# EAGLE schematic Arduino_fuer_LEDs_DCC_1.8.2 (EAGLE 9.6.2)

## Sheet 1 of 2
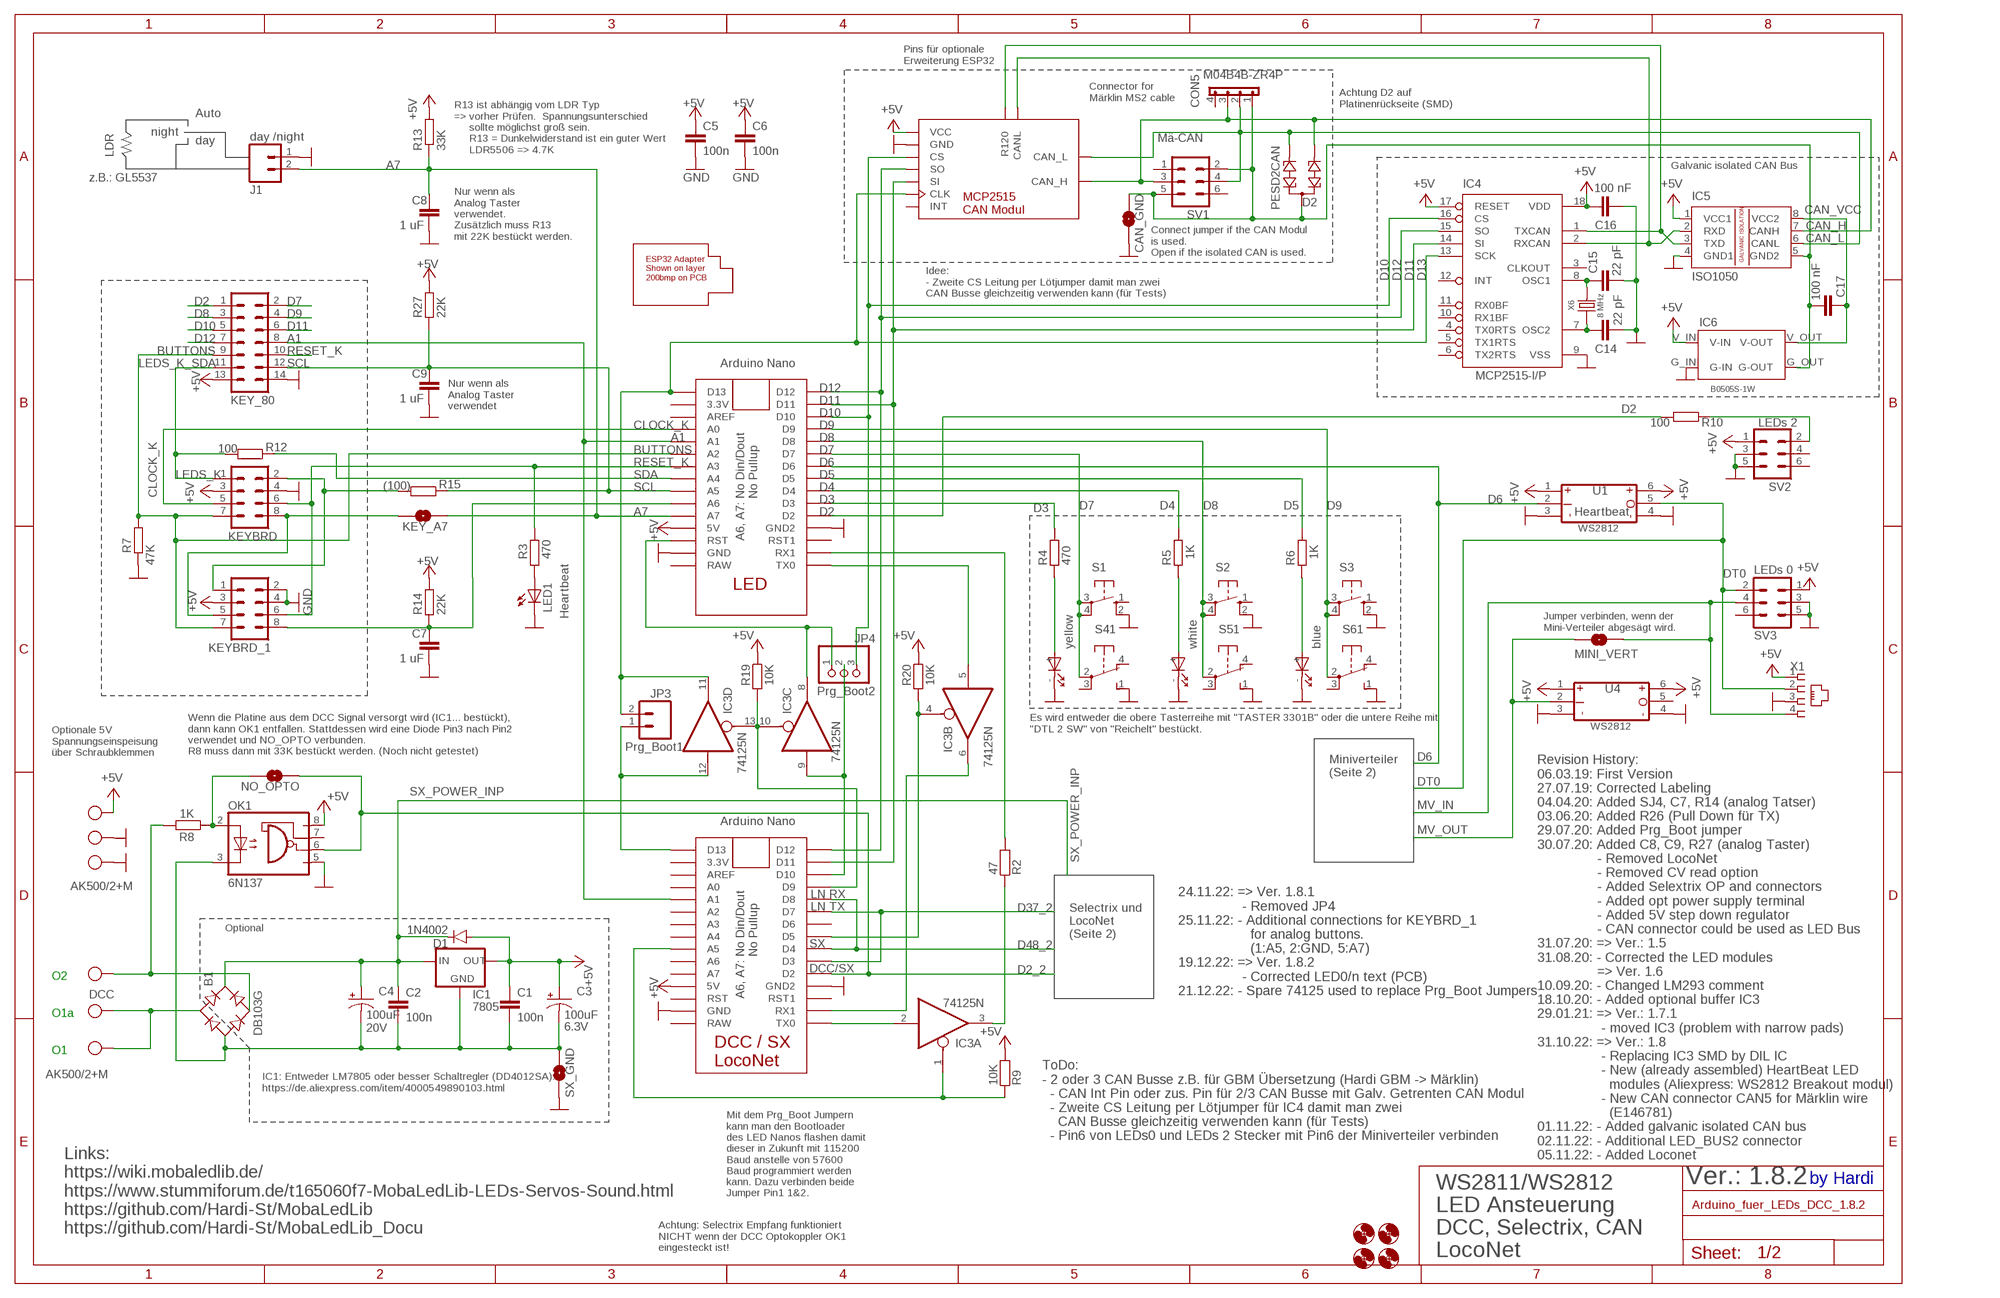
[diagram p0: schematic, sheet 1]

### Parts
B1  DB103G  DBDB10G  [DB]
C1  100n  C-EU025-025X050  [C025-025X050]
C2  100n  C-EU025-025X050  [C025-025X050]
C3  100uF  SPARKFUN-CAPACITORS_100UF-25V-20%(PTH)  [SPARKFUN-CAPACITORS_CPOL-RADIAL-100UF-25V]
C4  100uF  SPARKFUN-CAPACITORS_100UF-25V-20%(PTH)  [SPARKFUN-CAPACITORS_CPOL-RADIAL-100UF-25V]
C5  100n  C-EU025-025X050  [C025-025X050]
C6  100n  C-EU025-025X050  [C025-025X050]
C7  1 uF  C-EU025-025X050  [C025-025X050]
C8  1 uF  C-EU025-025X050  [C025-025X050]
C9  1 uF  C-EU025-025X050  [C025-025X050]
C14  22 pF  C2.5/2  [C2.5-2]
C15  22 pF  C2.5/2  [C2.5-2]
C16  100 nF  C2.5/2  [C2.5-2]
C17  100 nF  C2.5/2  [C2.5-2]
CAN2  MCP2515_CAN_MODUL  [MCP2515_CAN_MODUL]
CAN_GND  SOLDERJUMPERNO  [SJ_2S-NO]
CON5  M04B4B-ZR4P  [B4B-ZR4P]
D1  1N4002  1N4004  [DO41-10]
D2  PESD2CAN  PESD1CAN  [SOT23]
H1  MOUNT-HOLE3.0  [3,0]
H2  MOUNT-HOLE3.0  [3,0]
H3  MOUNT-HOLE3.0  [3,0]
H4  MOUNT-HOLE3.0  [3,0]
IC1  7805  78XXS  [78XXS]
IC3  74125N  [DIL14]
IC4  MCP2515-I/P  [DIL18]
IC5  ISO1050  [DIL08]
IC6  B0505S-1W  DCDC  [DCDC-TEA_NME]
J1  day /night  M02PTH  [1X02]
JP3  Prg_Boot1  M02PTH  [1X02]
JP4  Prg_Boot2  PINHD-1X3CB  [1X03-CLEANBIG]
KEY_80  ML14  [ML14]
KEY_A7  SOLDERJUMPERNO  [SJ_2S-NO]
KEYBRD  CON-HARTING-ML_ML08  [CON-HARTING-ML_ML08]
KEYBRD_1  CON-HARTING-ML_ML08  [CON-HARTING-ML_ML08]
LED1  Heartbeat  LED3MM  [LED3MM]
MINI_VERT  SOLDERJUMPERNO  [SJ_2S-NO]
NO_OPTO  SOLDERJUMPERNO  [SJ_2S-NO]
OK1  6N137  [DIL08]
R2  47  R-EU_0204/7  [0204/7]
R3  470  R0204/7  [0204/7]
R4  470  R0204/7  [0204/7]
R5  1K  R0204/7  [0204/7]
R6  1K  R0204/7  [0204/7]
R7  47K  R0204/7  [0204/7]
R8  1K  R0204/7  [0204/7]
R9  10K  R-EU_0204/7  [0204/7]
R10  100  R0204/7  [0204/7]
R12  100  R0204/7  [0204/7]
R13  33K  R0204/7  [0204/7]
R14  22K  R0204/7  [0204/7]
R15  (100)  R0204/7  [0204/7]
R19  10K  R-EU_0207/2V  [0207/2V]
R20  10K  R-EU_0207/2V  [0207/2V]
R27  22K  R0204/7  [0204/7]
S1  10-XX  [B3F-10XX]
S2  10-XX  [B3F-10XX]
S3  10-XX  [B3F-10XX]
S4  yellow  SRKL  [SRKL]
S5  white  SRKL  [SRKL]
S6  blue  SRKL  [SRKL]
SV1  Mä-CAN  ML6  [ML6]
SV2  LEDs 2  ML6  [ML6]
SV3  LEDs 0  ML6  [ML6]
SX_GND  SOLDERJUMPERNO  [SJ_2S-NO]
U1  WS2812_BREAKOUT  [WS2812__BREAKOUT]
U2  LED NANO  NANO  [NANO]
U3  DCC NANO  NANO  [NANO]
U4  WS2812_BREAKOUT  [WS2812__BREAKOUT]
U$1  ESP_ADAPTER  [ESP_ADAPTER]
X1  RJ10  [RJ10]
X2  AK500/2+M  [AK500/2+M]
X4  AK500/2+M  [AK500/2+M]
X6  8 MHz  CRYSTAL-HC49U-V  [HC49U-V]

### Nets
+5V: C1.1 C3.1(+) C5.1 C6.1 C16.1 CAN2.1(VCC) D1.A IC1.OUT IC4.17(RESET) IC4.18(VDD) IC5.1(VCC1) IC6.V_IN(V-IN) KEY_80.13 KEYBRD.3 KEYBRD_1.3 OK1.8(VCC) R9.2 R13.2 R14.2 R19.1 R20.1 R27.2 SV2.1 SV3.1 U1.1(VDD1) U1.6(VDD) U2.5V U3.5V U4.1(VDD1) U4.6(VDD) X1.1 X4.2 ; also sheet 2
A1: KEY_80.8 U2.A1 U3.A1
A7: C8.1 J1.2 KEY_A7.1 R13.1 U2.A7
BUTTONS: KEY_80.9 KEYBRD.7 KEYBRD_1.7 R7.2 U2.A2
CAN_H: CAN2.9(CAN_H) CON5.3 D2.1 IC5.7(CANH) SV1.3
CAN_L: CAN2.8(CAN_L) CON5.2 D2.2 IC5.6(CANL) SV1.4
CAN_VCC: C17.1 IC5.8(VCC2) IC6.V_OUT(V-OUT)
CLOCK_K: KEYBRD.5 U2.A0
D2: KEY_80.1 R10.2 U2.D2
D2_2: NO_OPTO.1 OK1.6(VO) U3.D2 ; also sheet 2
D3: R4.2 U2.D3
D4: R5.2 U2.D4
D5: R6.2 U2.D5
D6: U1.2(DIN) U2.D6
D7: KEY_80.2 S1.3(P) S1.4(P1) S4.2(1:P) U2.D7
D8: KEY_80.3 S2.3(P) S2.4(P1) S5.2(1:P) U2.D8
D9: KEY_80.4 S3.3(P) S3.4(P1) S6.2(1:P) U2.D9
D10: CAN2.3(CS) IC4.16(CS) JP4.3 KEY_80.5 U2.D10
D11: CAN2.5(SI) IC4.14(SI) KEY_80.6 U2.D11 U3.D11
D12: CAN2.4(SO) IC4.15(SO) KEY_80.7 U2.D12 U3.D12
D13: CAN2.6(CLK) IC3.11(D:O) IC4.13(SCK) JP3.2 U2.D13
D37_2: U3.D3 U3.D7 ; also sheet 2
D48_2: U3.D4 U3.D8 ; also sheet 2
DCC/SX_GND: B1.- C1.2 C2.2 C3.2(-) C4.2(-) IC1.GND OK1.3(C) SX_GND.1
DT0: SV3.2 U1.5(DO) X1.2
GND: C5.2 C6.2 C7.2 C8.2 C9.2 C14.2 C15.2 C16.2 CAN2.2(GND) CAN_GND.2 IC4.9(VSS) IC5.4(GND1) IC6.G_IN(G-IN) J1.1 KEY_80.14 KEYBRD.4 KEYBRD_1.2 KEYBRD_1.4 LED1.K(C) OK1.5(GND) R7.1 S1.2(S1) S2.2(S1) S3.2(S1) S4.1(1:S) S4.-(D1:C) S5.1(1:S) S5.-(D1:C) S6.1(1:S) S6.-(D1:C) SV2.3 SV2.5 SV3.3 SV3.5 SX_GND.2 U1.3(GND1) U1.4(GND) U2.GND U2.GND1(GND2) U3.GND U3.GND1(GND2) U4.3(GND1) U4.4(GND) X1.3 X4.1 X4.M ; also sheet 2
GND2: C17.2 CAN_GND.1 CON5.1 D2.3 IC5.5(GND2) IC6.G_OUT(G-OUT) SV1.2 SV1.5
LEDS_K_SDA: KEY_80.11 KEYBRD.1 R12.2
MV_IN: MINI_VERT.2 SV3.4 X1.4 ; also sheet 2
MV_OUT: MINI_VERT.1 U4.2(DIN) ; also sheet 2
N$1: IC3.5(B:I) U2.TX0
N$3: IC3.1(A:OE) R9.1 U3.A5
N$4: R4.1 S4.+(D1:A)
N$5: R10.1 SV2.2
N$6: R5.1 S5.+(D1:A)
N$7: R6.1 S6.+(D1:A)
N$8: B1.AC1 X2.1 X2.M
N$11: IC3.10(C:OE) IC3.13(D:OE) R19.2 U3.D9
N$12: B1.AC2 R8.2 X2.2
N$15: IC3.8(C:O) JP4.1 U2.RST
N$16: IC3.4(B:OE) R20.2 U3.D5
N$18: IC3.6(B:O) U3.RX1
N$19: LED1.A R3.1
N$20: IC3.12(D:I) JP3.1 U3.D13
N$21: NO_OPTO.2 OK1.2(A) R8.1
N$24: KEYBRD.2 KEYBRD_1.1 R15.2
N$25: KEY_A7.2 KEYBRD.8 KEYBRD_1.5
N$27: C7.1 KEYBRD_1.8 R14.1 U2.A6
N$28: IC3.9(C:I) JP4.2 U3.D10
N$31: IC3.2(A:I) U3.TX0
N$33: IC3.3(A:O) R2.1
N$34: R2.2 U2.RX1
OSC1: C15.1 IC4.8(OSC1) X6.2
OSC2: C14.1 IC4.7(OSC2) X6.1
RESET_K: KEY_80.10 KEYBRD.6 KEYBRD_1.6 R3.2 U2.A3
RXCAN: CAN2.11(CANL) IC4.2(RXCAN) IC5.2(RXD)
SCL: C9.1 KEY_80.12 R15.1 R27.1 U2.A5
SDA: R12.1 U2.A4
SX_POWER_INP: B1.+ C2.1 C4.1(+) D1.C IC1.IN ; also sheet 2
TXCAN: CAN2.10(R120) IC4.1(TXCAN) IC5.3(TXD)
Unconnected: CAN2.7(INT) CON5.4 IC4.3(CLKOUT) IC4.4(TX0RTS) IC4.5(TX1RTS) IC4.6(TX2RTS) IC4.10(RX1BF) IC4.11(RX0BF) IC4.12(INT) OK1.7(VE) S1.1(S) S2.1(S) S3.1(S) S4.3(1:P) S4.4(1:O) S5.3(1:P) S5.4(1:O) S6.3(1:P) S6.4(1:O) SV1.1 SV1.6 SV2.4 SV2.6 SV3.6 U2.3.3V U2.AREF U2.RAW U2.RST1 U3.3.3V U3.A0 U3.A2 U3.A3 U3.A4 U3.A6 U3.A7 U3.AREF U3.D6 U3.RAW U3.RST U3.RST1 U4.5(DO)

### Notes on the sheet
- Pins für optionale
  Erweiterung ESP32
- R13 ist abhängig vom LDR Typ
  => vorher Prüfen.  Spannungsunterschied
       sollte möglichst groß sein.
       R13 = Dunkelwiderstand ist ein guter Wert
       LDR5506 => 4.7K
- Connector for
  Märklin MS2 cable
- Achtung D2 auf 
  Platinenrückseite (SMD)
- Auto
- night
- day
- LDR
- Galvanic isolated CAN Bus
- z.B.: GL5537
- Nur wenn als
  Analog Taster
  verwendet.
  Zusätzlich muss R13 
  mit 22K bestückt werden.
- Connect jumper if the CAN Modul
  is used.
  Open if the isolated CAN is used.
- Idee:
  - Zweite CS Leitung per Lötjumper damit man zwei 
  CAN Busse gleichzeitig verwenden kann (für Tests)
- Nur wenn als
  Analog Taster
  verwendet
- LEDS_K
- Heartbeat
- A6, A7: No Din/Dout 
              No Pullup
- LED
- Jumper verbinden, wenn der
  Mini-Verteiler abgesägt wird.
- Wenn die Platine aus dem DCC Signal versorgt wird (IC1... bestückt), 
  dann kann OK1 entfallen. Stattdessen wird eine Diode Pin3 nach Pin2
  verwendet und NO_OPTO verbunden.
  R8 muss dann mit 33K bestückt werden. (Noch nicht getestet)
- Es wird entweder die obere Tasterreihe mit "TASTER 3301B" oder die untere Reihe mit 
  "DTL 2 SW" von "Reichelt" bestückt.
- Optionale 5V
  Spannungseinspeisung
  über Schraubklemmen
- Miniverteiler
  (Seite 2)
- 24.11.22: => Ver. 1.8.1
                  - Removed JP4
  25.11.22: - Additional connections for KEYBRD_1
                    for analog buttons.
                    (1:A5, 2:GND, 5:A7) 
  19.12.22: => Ver. 1.8.2
                  - Corrected LED0/n text (PCB)
  21.12.22: - Spare 74125 used to replace Prg_Boot Jumpers
- LN RX
- Selectrix und
  LocoNet
  (Seite 2)
- LN TX
- Optional
- SX
- DCC/SX
- O2
- DCC
- A6, A7: No Din/Dout 
              No Pullup
- O1a
- DCC / SX
  LocoNet
- O1
- ToDo:
  - 2 oder 3 CAN Busse z.B. für GBM Übersetzung (Hardi GBM -> Märklin)
    - CAN Int Pin oder zus. Pin für 2/3 CAN Busse mit Galv. Getrenten CAN Modul
    - Zweite CS Leitung per Lötjumper für IC4 damit man zwei 
      CAN Busse gleichzeitig verwenden kann (für Tests)
    - Pin6 von LEDs0 und LEDs 2 Stecker mit Pin6 der Miniverteiler verbinden
- IC1: Entweder LM7805 oder besser Schaltregler (DD4012SA):
  https://de.aliexpress.com/item/4000549890103.html
- Revision History:
  06.03.19: First Version
  27.07.19: Corrected Labeling
  04.04.20: Added SJ4, C7, R14 (analog Tatser)
  03.06.20: Added R26 (Pull Down für TX)
  29.07.20: Added Prg_Boot jumper
  30.07.20: Added C8, C9, R27 (analog Taster)
                 - Removed LocoNet
                 - Removed CV read option
                 - Added Selextrix OP and connectors
                 - Added opt power supply terminal 
                 - Added 5V step down regulator
                 - CAN connector could be used as LED Bus
  31.07.20: => Ver.: 1.5
  31.08.20: - Corrected the LED modules
                 => Ver. 1.6
  10.09.20: - Changed LM293 comment
  18.10.20: - Added optional buffer IC3
  29.01.21: => Ver.: 1.7.1
                  - moved IC3 (problem with narrow pads)
  31.10.22: => Ver.: 1.8
                  - Replacing IC3 SMD by DIL IC
                  - New (already assembled) HeartBeat LED
                    modules (Aliexpress: WS2812 Breakout modul)
                  - New CAN connector CAN5 for Märklin wire 
                    (E146781)
  01.11.22: - Added galvanic isolated CAN bus
  02.11.22: - Additional LED_BUS2 connector
  05.11.22: - Added Loconet
- Ver.: 1.8.2 | by Hardi
- Mit dem Prg_Boot Jumpern
  kann man den Bootloader
  des LED Nanos flashen damit
  dieser in Zukunft mit 115200
  Baud anstelle von 57600
  Baud programmiert werden 
  kann. Dazu verbinden beide
  Jumper Pin1 1&2.
- Achtung: Selectrix Empfang funktioniert
  NICHT wenn der DCC Optokoppler OK1
  eingesteckt ist!
- Links:
  https://wiki.mobaledlib.de/
  https://www.stummiforum.de/t165060f7-MobaLedLib-LEDs-Servos-Sound.html 
  https://github.com/Hardi-St/MobaLedLib
  https://github.com/Hardi-St/MobaLedLib_Docu
- WS2811/WS2812
  LED Ansteuerung
  DCC, Selectrix, CAN
  LocoNet

## Sheet 2 of 2
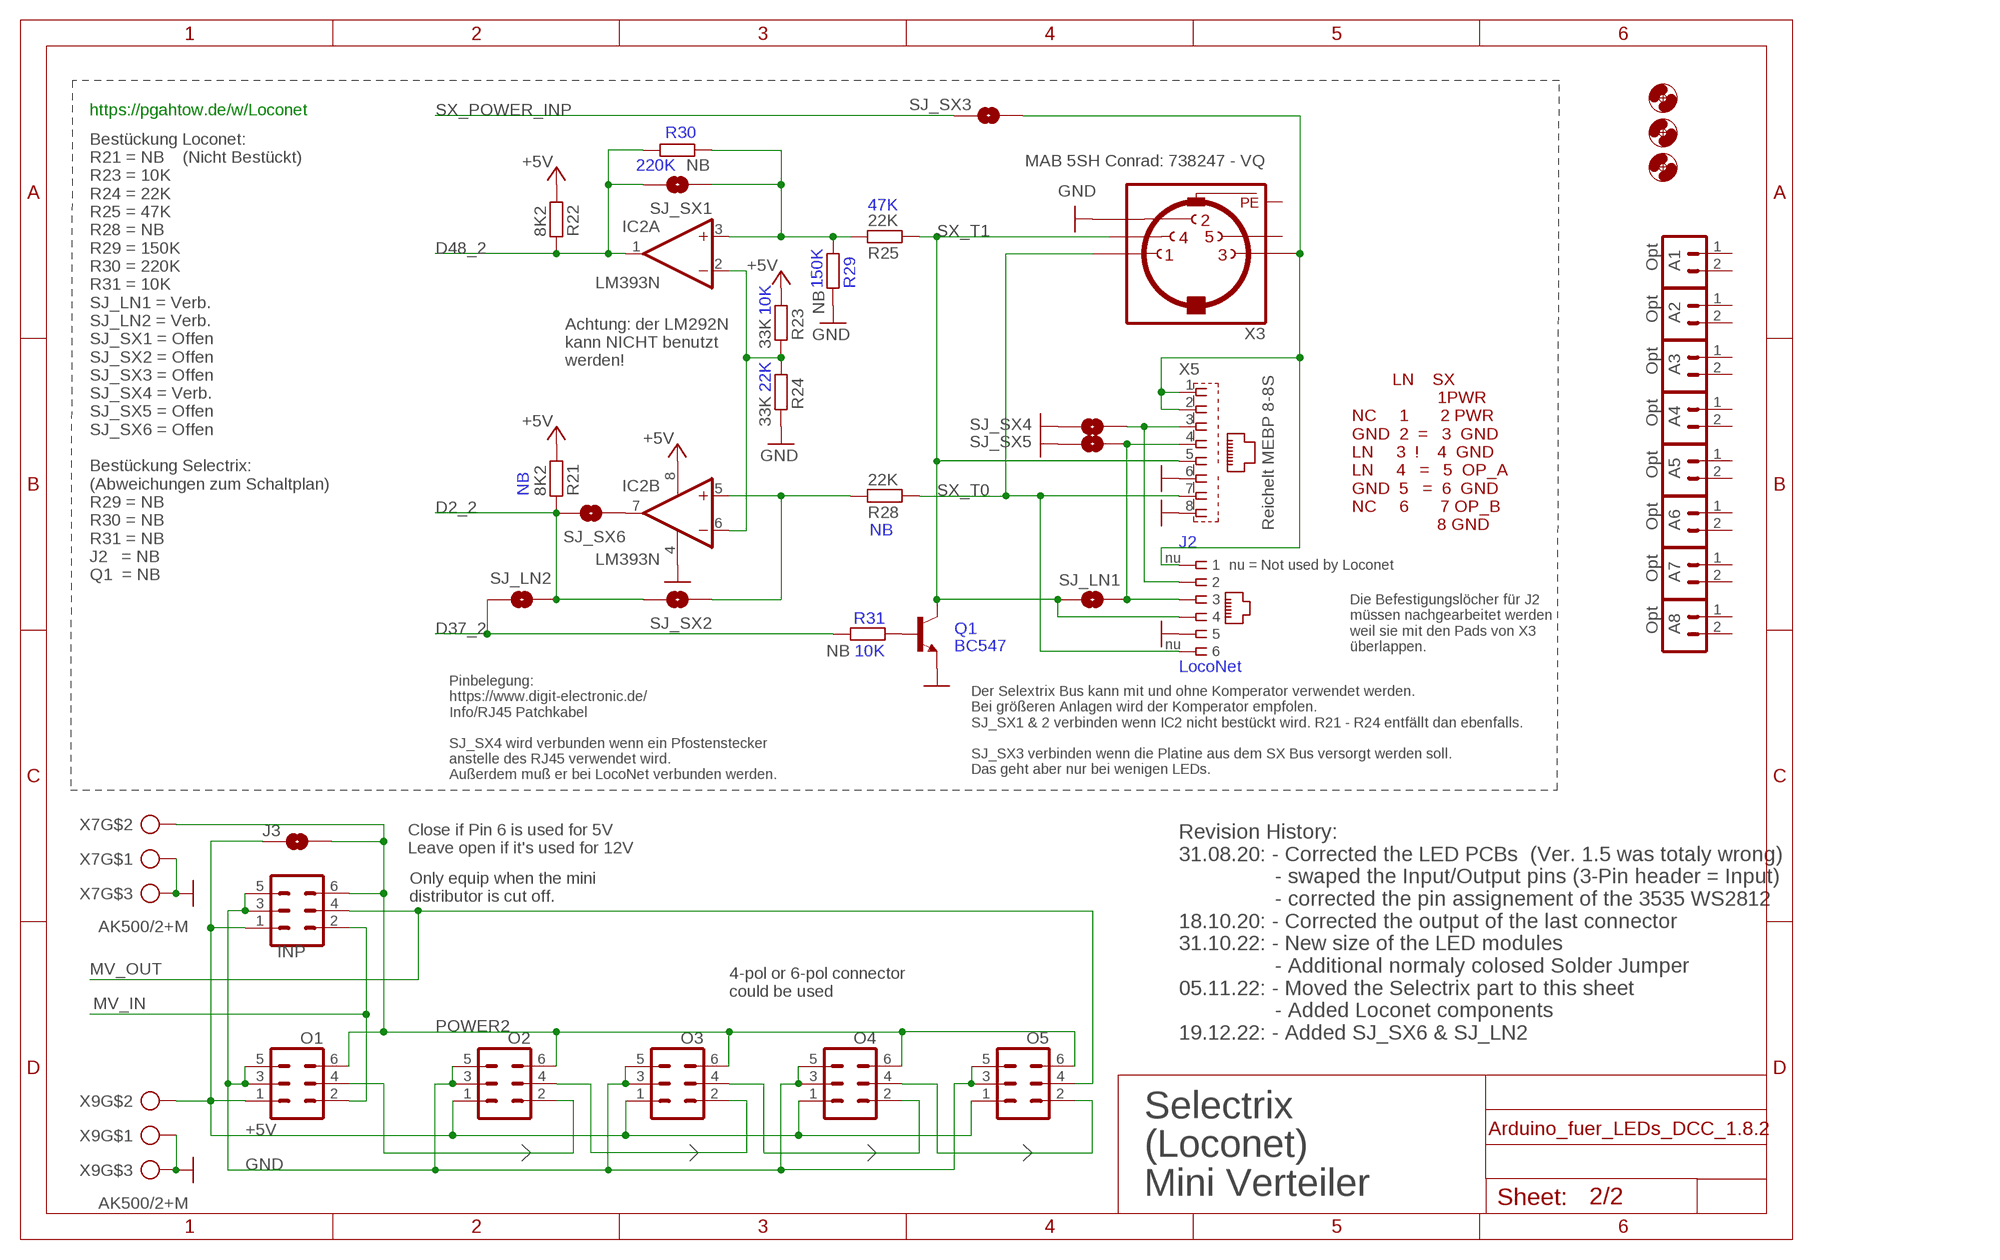
[diagram p1: schematic, sheet 2]

### Parts
A1  Opt  M02PTH  [1X02]
A2  Opt  M02PTH  [1X02]
A3  Opt  M02PTH  [1X02]
A4  Opt  M02PTH  [1X02]
A5  Opt  M02PTH  [1X02]
A6  Opt  M02PTH  [1X02]
A7  Opt  M02PTH  [1X02]
A8  Opt  M02PTH  [1X02]
H5  MOUNT-HOLE3.0  [3,0]
H6  MOUNT-HOLE3.0  [3,0]
H7  MOUNT-HOLE3.0  [3,0]
IC2  LM393N  [DIL08]
INP  ML6  [ML6]
J2  LocoNet  RJ11NO_MOUNTING_HOLE  [RJ11-NO_SHIELD_NO_MOUNT_HOULE]
J3  SOLDERJUMPERNO  [SJ_2S-NO]
O1  ML6  [ML6]
O2  ML6  [ML6]
O3  ML6  [ML6]
O4  ML6  [ML6]
O5  ML6  [ML6]
Q1  BC547  [TO92]
R21  8K2  R-EU_0207/2V  [0207/2V]
R22  8K2  R-EU_0207/2V  [0207/2V]
R23  33K  R-EU_0207/2V  [0207/2V]
R24  33K  R-EU_0207/2V  [0207/2V]
R25  22K  R-EU_0207/2V  [0207/2V]
R28  22K  R-EU_0207/2V  [0207/2V]
R29  150K  R-EU_0207/2V  [0207/2V]
R30  220K  R-EU_0207/2V  [0207/2V]
R31  10K  R-EU_0207/2V  [0207/2V]
SJ_LN1  SOLDERJUMPERNO  [SJ_2S-NO]
SJ_LN2  SOLDERJUMPERNO  [SJ_2S-NO]
SJ_SX1  SOLDERJUMPERNO  [SJ_2S-NO]
SJ_SX2  SOLDERJUMPERNO  [SJ_2S-NO]
SJ_SX3  SOLDERJUMPERNO  [SJ_2S-NO]
SJ_SX4  SOLDERJUMPERNO  [SJ_2S-NO]
SJ_SX5  SOLDERJUMPERNO  [SJ_2S-NO]
SJ_SX6  SOLDERJUMPERNO  [SJ_2S-NO]
X3  MAB 5SH Conrad: 738247 - VQ  MAB5SH  [MAB5SH]
X5  Reichelt MEBP 8-8S  RJ45_MEBP8-8S  [RJ45_MEBP8-8S]
X7  AK500/2+M  [AK500/2+M]
X9  AK500/2+M  [AK500/2+M]

### Nets
+5V: IC2.8(P:V+) INP.1 J3.1 O1.1 O2.1 O3.1 O4.1 O5.1 R21.2 R22.2 R23.2 X9.2 ; also sheet 1
D2_2: R21.1 SJ_LN2.1 SJ_SX2.2 SJ_SX6.2 ; also sheet 1
D37_2: R31.2 SJ_LN2.2 ; also sheet 1
D48_2: IC2.1(A:OUT) R22.1 R30.2 SJ_SX1.2 ; also sheet 1
GND: IC2.4(P:V-) INP.3 INP.5 J2.5 O1.3 O1.5 O2.3 O2.5 O3.3 O3.5 O4.3 O4.5 O5.3 O5.5 Q1.1(E) R24.1 R29.1 SJ_SX4.2 SJ_SX5.2 X3.2 X5.6 X5.8 X7.1 X7.M X9.1 X9.M ; also sheet 1
MV_IN: INP.2 O1.2 ; also sheet 1
MV_OUT: INP.4 O5.4 ; also sheet 1
N$2: J2.1 SJ_SX3.1 X3.3 X5.1 X5.2
N$9: J2.2 SJ_SX4.1 X5.3
N$10: IC2.7(B:OUT) SJ_SX6.1
N$14: Q1.2(B) R31.1
N$22: O3.4 O4.2
N$35: O1.4 O2.2
N$37: O4.4 O5.2
N$38: IC2.2(A:-IN) IC2.6(B:-IN) R23.1 R24.2
N$39: IC2.3(A:+IN) R25.1 R29.2 R30.1 SJ_SX1.1
N$40: J2.3 SJ_LN1.1 SJ_SX5.1 X5.4
N$42: IC2.5(B:+IN) R28.1 SJ_SX2.1
N$58: O2.4 O3.2
POWER2: INP.6 J3.2 O1.6 O2.6 O3.6 O4.6 O5.6 X7.2
SX_POWER_INP: SJ_SX3.2 ; also sheet 1
SX_T0: J2.6 R28.2 X3.1 X5.7
SX_T1: J2.4 Q1.3(C) R25.2 SJ_LN1.2 X3.4 X5.5
Unconnected: A1.1 A1.2 A2.1 A2.2 A3.1 A3.2 A4.1 A4.2 A5.1 A5.2 A6.1 A6.2 A7.1 A7.2 A8.1 A8.2 X3.5

### Notes on the sheet
- https://pgahtow.de/w/Loconet
- Bestückung Loconet:
  R21 = NB    (Nicht Bestückt)
  R23 = 10K
  R24 = 22K
  R25 = 47K
  R28 = NB
  R29 = 150K
  R30 = 220K
  R31 = 10K
  SJ_LN1 = Verb.
  SJ_LN2 = Verb.
  SJ_SX1 = Offen
  SJ_SX2 = Offen
  SJ_SX3 = Offen
  SJ_SX4 = Verb.
  SJ_SX5 = Offen
  SJ_SX6 = Offen
  
  Bestückung Selectrix:
  (Abweichungen zum Schaltplan)
  R29 = NB
  R30 = NB
  R31 = NB
  J2   = NB
  Q1  = NB
- NB
- 47K
- 10K
- NB
- Achtung: der LM292N
  kann NICHT benutzt
  werden!
- 22K
- NB
- LN    SX
                     1PWR 
  NC     1       2 PWR
  GND  2  =   3  GND
  LN     3  !    4  GND
  LN     4   =   5  OP_A
  GND  5   =  6  GND
  NC     6       7 OP_B
                     8 GND
- NB
- nu
- nu = Not used by Loconet
- Die Befestigungslöcher für J2
  müssen nachgearbeitet werden
  weil sie mit den Pads von X3 
  überlappen.
- nu
- NB
- Pinbelegung:
  https://www.digit-electronic.de/
  Info/RJ45 Patchkabel
  
  SJ_SX4 wird verbunden wenn ein Pfostenstecker
  anstelle des RJ45 verwendet wird.
  Außerdem muß er bei LocoNet verbunden werden.
- Der Selextrix Bus kann mit und ohne Komperator verwendet werden.
  Bei größeren Anlagen wird der Komperator empfolen. 
  SJ_SX1 & 2 verbinden wenn IC2 nicht bestückt wird. R21 - R24 entfällt dan ebenfalls.
  
  SJ_SX3 verbinden wenn die Platine aus dem SX Bus versorgt werden soll.
  Das geht aber nur bei wenigen LEDs.
- Revision History:
  31.08.20: - Corrected the LED PCBs  (Ver. 1.5 was totaly wrong)
                  - swaped the Input/Output pins (3-Pin header = Input)
                  - corrected the pin assignement of the 3535 WS2812
  18.10.20: - Corrected the output of the last connector 
  31.10.22: - New size of the LED modules
                  - Additional normaly colosed Solder Jumper 
  05.11.22: - Moved the Selectrix part to this sheet
                  - Added Loconet components
  19.12.22: - Added SJ_SX6 & SJ_LN2
- Close if Pin 6 is used for 5V
  Leave open if it's used for 12V
- Only equip when the mini
  distributor is cut off.
- 4-pol or 6-pol connector
  could be used
- Selectrix 
  (Loconet)
  Mini Verteiler

## Power pins joined to a net without a drawn wire
+5V: IC3.14(P:VCC)
GND: IC3.7(P:GND)
PE: X3.PE X3.PE@(PE)

## Library data of the parts
A1-A8 J1 JP3 = SparkFun-Connectors:M02: Standard 2-pin 0.1" header. Use with - straight break away headers ( PRT-00116) - right angle break away headers (PRT-00553) - swiss pins (PRT-00743) - machine pins (PRT-00117) - female headers (PRT-00115) Molex polarized connector foot print use with: PRT-08233 with associated crimp pins and housings. 2.54_SCREWTERM for use with PRT-10571. 3.5mm Screw Terminal footprints for PRT-08084 5mm Screw Terminal footprints for use with PRT-08432
B1 = Arduino_fuer_LEDs_DCC_2:DB?*G: Single Phase 1.0 AMP Glass Passivated Bridge Rectifier Taiwan Semiconductor Co.,Ltd. - TSC Source: http://www.taiwansemi.com/TSCbig5/ezcatfiles/cust/img/img/db101g.pdf http://www.ts.com.tw/db/pictures/modules/PDT/PDT060207001/DBLS201G.pdf
C1 C2 C5-C9 = rcl:C-EU: CAPACITOR, European symbol
C3 = Sound_MP3-TF-16P_and_WS2811:SPARKFUN-CAPACITORS_100UF-25V-20%(PTH): CAP-08439; PROD_ID: CAP-08439; VOLTAGE: 6.3V
C4 = Sound_MP3-TF-16P_and_WS2811:SPARKFUN-CAPACITORS_100UF-25V-20%(PTH): CAP-08439; PROD_ID: CAP-08439; VOLTAGE: 20V
C14-C17 = capacitor-wima:C: CAPACITOR naming: grid - package width
CAN2 = Arduino_fuer_LEDs_DCC_2_All:MCP2515_CAN_MODUL: MCP2515 CAN Modul
CAN_GND J3 KEY_A7 MINI_VERT NO_OPTO SJ_LN1 SJ_LN2 SJ_SX1-SJ_SX6 SX_GND = SparkFun-Retired:SOLDERJUMPER: Solder Jumper Standard SMD solder jumper. Used to automate production. Two varients : Normally Open and Normally Closed are the same, but have different paste layers. NC will have a large amount of paste and should jumper during reflow.
CON5 = Connectors_Inline3_7:M04
D1 = diode:1N4004: DIODE general purpose rectifier, 1 A
D2 = diode:PESD1CAN: CAN bus ESD protection diode Source: http://www.nxp.com/documents/data_sheet/PESD1CAN.pdf
H1-H7 = holes:MOUNT-HOLE: MOUNTING HOLE with drill center marker
IC1 = v-reg:78XXS: VOLTAGE REGULATOR
IC2 = linear:LM393: COMPARATOR
IC3 = 74xx-us:74*125: Quad bus BUFFER, 3-state
IC4 = mcp2515:MCP2515
IC5 = texas:ISO1050: ISOLATED CAN TRANSCEIVER Source: http://focus.ti.com/lit/ds/symlink/iso1050.pdf Hardi: Added DIL08 Package
IC6 = MLL-Dominik-Hardi:DCDC
INP O1-O5 = con-harting-ml:ML6: HARTING; OC_FARNELL: unknown; OC_NEWARK: unknown
J2 = con-tycoelectronics:RJ11: CORCOM Modular RJ Jacks No Shield Source: www.tycoelectronics.com .. ENG_DS_1654001_1099_RJ_L_0507.pdf
JP4 = adafruit:PINHD-1X3: PIN HEADER
KEY_80 = Arduino_fuer_LEDs_DCC_2:ML14: HARTING; OC_FARNELL: unknown; OC_NEWARK: unknown
KEYBRD KEYBRD_1 = PushButtonAction_4017_2:CON-HARTING-ML_ML08: Modified by Hardi; OC_FARNELL: unknown; OC_NEWARK: unknown
LED1 = Arduino_fuer_LEDs_DCC_2:LED: LED OSRAM: - CHIPLED LG R971, LG N971, LY N971, LG Q971, LY Q971, LO R971, LY R971 LH N974, LH R974 LS Q976, LO Q976, LY Q976 LO Q996 - Hyper CHIPLED LW Q18S LB Q993, LB Q99A, LB R99A - SideLED LS A670, LO A670, LY A670, LG A670, LP A670 LB A673, LV A673, LT A673, LW A673 LH A674 LY A675 LS A676, LA A676, LO A676, LY A676, LW A676 LS A679, LY A679, LG A679 - Hyper Micro SIDELED® LS Y876, LA Y876, LO Y876, LY Y876 LT Y87S - SmartLED LW L88C, LW L88S LB L89C, LB L89S, LG L890 LS L89K, LO L89K, LY L89K LS L896, LA L896, LO L896, LY L896 - TOPLED LS T670, LO T670, LY T670, LG T670, LP T670 LSG T670, LSP T670, LSY T670, LOP T670, LYG T670 LG T671, LOG T671, LSG T671 LB T673, LV T673, LT T673, LW T673 LH T674 LS T676, LA T676, LO T676, LY T676, LB T676, LH T676, LSB T676, LW T676 LB T67C, LV T67C, LT T67C, LS T67K, LO T67K, LY T67K, LW E67C LS E67B, LA E67B, LO E67B, LY E67B, LB E67C, LV E67C, LT E67C LW T67C LS T679, LY T679, LG T679 LS T770, LO T770, LY T770, LG T770, LP T770 LB T773, LV T773, LT T773, LW T773 LH T774 LS E675, LA E675, LY E675, LS T675 LS T776, LA T776, LO T776, LY T776, LB T776 LHGB T686 LT T68C, LB T68C - Hyper Mini TOPLED® LB M676 - Mini TOPLED Santana® LG M470 LS M47K, LO M47K, LY M47K Source: http://www.osram.convergy.de LUXEON: - LUMILED® LXK2-PW12-R00, LXK2-PW12-S00, LXK2-PW14-U00, LXK2-PW14-V00 LXK2-PM12-R00, LXK2-PM12-S00, LXK2-PM14-U00 LXK2-PE12-Q00, LXK2-PE12-R00, LXK2-PE12-S00, LXK2-PE14-T00, LXK2-PE14-U00 LXK2-PB12-K00, LXK2-PB12-L00, LXK2-PB12-M00, LXK2-PB14-N00, LXK2-PB14-P00, LXK2-PB14-Q00 LXK2-PR12-L00, LXK2-PR12-M00, LXK2-PR14-Q00, LXK2-PR14-R00 LXK2-PD12-Q00, LXK2-PD12-R00, LXK2-PD12-S00 LXK2-PH12-R00, LXK2-PH12-S00 LXK2-PL12-P00, LXK2-PL12-Q00, LXK2-PL12-R00 Source: www.luxeon.com KINGBRIGHT: KA-3528ASYC Source: www.kingbright.com
OK1 = Arduino_fuer_LEDs_DCC_2:6N137: MOTOROLA OPTO COUPLER; MPN: 6N137; OC_FARNELL: 1328376; OC_NEWARK: 52M1895
Q1 = transistor-npn:BC547*: NPN Transistor
R2 R9 R19-R25 R28-R31 = rcl:R-EU_: RESISTOR, European symbol
R3-R8 R10 R12-R15 R27 = Arduino_fuer_LEDs_DCC_2:R: RESISTOR, European symbol; SPICEMODEL: NONE; SPICEPREFIX: R
S1-S3 = switch-omron:10-XX: OMRON SWITCH; MPN: B3F-1000; OC_FARNELL: 176432; OC_NEWARK: 36M3542
S4-S6 = switch-misc:SRKL: SWITCH
SV1-SV3 = Arduino_fuer_LEDs_DCC_2:ML6: HARTING; OC_FARNELL: unknown; OC_NEWARK: unknown
U1 U4 = Arduino_fuer_LEDs_DCC_2_All:WS2812_BREAKOUT: WS2812 Modul mit Winkelsteckern (by Hardi)
U2 U3 = Arduino_fuer_LEDs_DCC_2:NANO: Arduino Nano
U$1 = ESP_Adapterplatine_Outline:ESP_ADAPTER
X1 = RJ10:RJ10: RJ10 Connector "C:\Dat\Märklin\Schaltpläne\Allgemein\RJ10_Stecker_Layout.docx" https://de.aliexpress.com/item/100-pcs-lot-RJ11-Grau-4P4-Telefon-Buchse-4P4C-Telefon-Halter-RJ10-Telefon-Halter-PCB-Empf/32951511491.html?spm=a2g0x.search0604.3.106.53184c516NAPTE&transAbTest=ae803_4&ws_ab_test=searchweb0_0%2Csearchweb201602_3_10065_10068_10547_319_317_10548_10696_10084_453_10083_454_10618_10304_10307_10820_10821_537_10302_536_10902_10843_10059_10884_10887_321_322_10103%2Csearchweb201603_57%2CppcSwitch_0&algo_pvid=cf281ae9-d22a-4418-b1b2-d9dd3eca3a16&algo_expid=cf281ae9-d22a-4418-b1b2-d9dd3eca3a16-15; OC_FARNELL: unknown; OC_NEWARK: unknown
X2 X4 X7 X9 = Arduino_fuer_LEDs_DCC_2:AK500/2+M
X3 = con-hirschmann:MAB5SH: Female CONNECTOR 5 pins 90 deg. with shield, horizontal (DIN 41524); OC_FARNELL: 809883; OC_NEWARK: unknown
X5 = RJ45_Reichelt:RJ45_MEBP8-8S: AMP connector
X6 = Discrete:CRYSTAL*: CRYSTAL